# EasyEDA Pro project Excam多功能小相机.epro, board PCB2_1
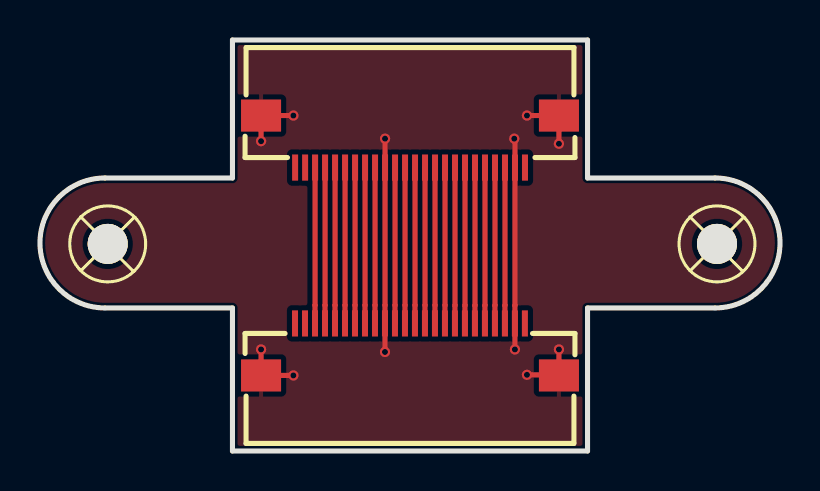
[diagram p0: board, top side]
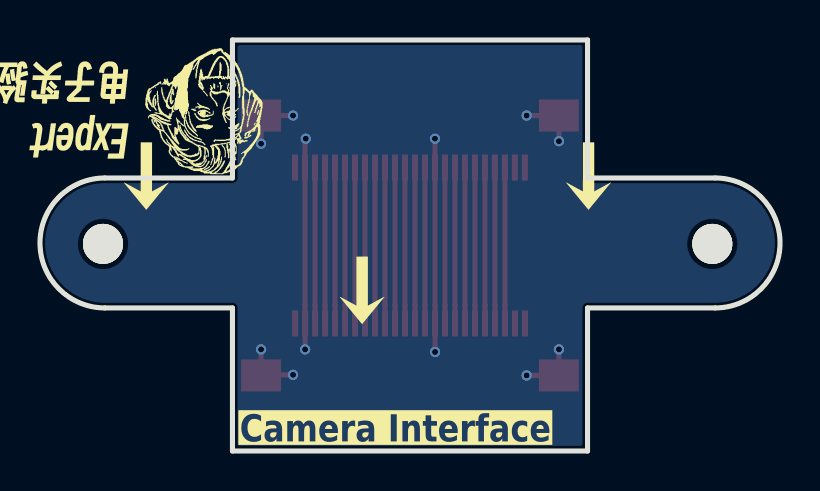
[diagram p1: board, bottom side, seen from below]

Outline 37.02 x 20.56 mm; copper layers: Top Layer, Bottom Layer. Coordinates in mm from the lower left corner of the outline.
Outline path: 3.25,13.66 9.63,13.66 9.63,20.56 27.39,20.56 27.39,13.66 33.77,13.66 arc(37.02,10.41) 33.77,7.16 27.39,7.16 27.39,0 9.63,0 9.63,7.16 3.25,7.16 arc(0,10.41) 3.25,13.66
Stack: Top Layer 0.035mm / Dielectric1 1.51mm FR4 er 4.5 / Bottom Layer 0.035mm

## Design rules (mm)
template: 自定义配置
spacing copperThickness1oz (default): track to track 0.102, other pairs 0.152 to 0.3
spacing copperThickness2oz: track to track 0.203, other pairs 0.152 to 0.3
track width copperThickness1oz (default): min 0.127, default 0.254, max 2.54
track width copperThickness2oz: min 0.203, default 0.254, max 2.54
differential pair differentialPair (default): width min 0.127, default 0.254, max 2.54; gap min 0.152, default 0.152
via viaSize (default): diameter min 0.5, default 0.61, max 10; hole min 0.3, default 0.305, max 6.3

## Placement (name value [footprint] x y rotation side)
FPC1  AFC01-S24FCA-00  [FPC-SMD_P0.50-24P_FGS-XJ-H2.0]  18.51 15.48 0 top
FPC2  AFC01-S24FCA-00  [FPC-SMD_P0.50-24P_FGS-XJ-H2.0]  18.51 5.08 180 top
TP1  -  [M2螺丝]  33.87 10.36 180 top
TP2  -  [M2螺丝]  3.39 10.36 180 top

## Footprints (pads in the part's own frame, mm; a bottom-side part is the same pattern mirrored in y, then rotated)
FPC-SMD_P0.50-24P_FGS-XJ-H2.0
  rect 0.3x1.3 smd: 1(-5.748,-1.3) 2(-5.248,-1.3) 3(-4.748,-1.3) 4(-4.248,-1.3) 5(-3.748,-1.3) 6(-3.248,-1.3) 7(-2.748,-1.3) 8(-2.248,-1.3) 9(-1.748,-1.3) 10(-1.248,-1.3) 11(-0.748,-1.3) 12(-0.248,-1.3) 13(0.252,-1.3) 14(0.752,-1.3) 15(1.252,-1.3) 16(1.752,-1.3) 17(2.252,-1.3) 18(2.752,-1.3) 19(3.252,-1.3) 20(3.752,-1.3) 21(4.252,-1.3) 22(4.752,-1.3) 23(5.252,-1.3) 24(5.752,-1.3)
  rect 2x1.6 smd: 25(7.45,1.3) 26(-7.45,1.3)
M2螺丝
  round 2 hole 2: 1(0,0)

## Nets
1.5V: FPC1.15 FPC2.10
2.8V-A: FPC1.21 FPC2.4
2.8V-D: FPC1.14 FPC2.11
GND: FPC1.10 FPC1.23 FPC1.25 FPC1.26 FPC2.2 FPC2.15 FPC2.25 FPC2.26
DCMI_CLK: FPC1.12 FPC2.13
DCMI_D0: FPC1.6 FPC2.19
DCMI_D1: FPC1.4 FPC2.21
DCMI_D2: FPC1.3 FPC2.22
DCMI_D3: FPC1.5 FPC2.20
DCMI_D4: FPC1.7 FPC2.18
DCMI_D5: FPC1.9 FPC2.16
DCMI_D6: FPC1.11 FPC2.14
DCMI_D7: FPC1.13 FPC2.12
DCMI_HSYNC: FPC1.16 FPC2.9
DCMI_PCLK: FPC1.8 FPC2.17
DCMI_PWDN: FPC1.17 FPC2.8
DCMI_RST: FPC1.19 FPC2.6
DCMI_VSYNC: FPC1.18 FPC2.7
I2C1_SCL: FPC1.20 FPC2.5
I2C1_SDA: FPC1.22 FPC2.3

Pads without a net: FPC1 1 2 24; FPC2 1 23 24; TP1 1; TP2 1

## Via types
v1: diameter 0.51, hole 0.305, Top Layer to Bottom Layer, 12 vias

## Routing (per net, layer and track width the routed paths; a pad name or vN(x,y) marks a point on that pad's centre or on a via; arc(x,y) is an arc through that point)
1.5V: length 7.8
  Top Layer w0.254: 19.76,6.38 19.76,7.28 19.76,7.29 FPC1.15
2.8V-A: length 7.8
  Top Layer w0.254: 22.76,6.38 22.76,7.28 22.76,7.29 FPC1.21
2.8V-D: length 7.8
  Top Layer w0.254: FPC1.14 19.26,7.29 19.26,7.28 19.26,6.38
GND: length 33
  Top Layer w0.254: v1(12.68,16.78) FPC1.26 v1(11.06,15.49) ; v1(17.26,4.95) 17.26,7.28 17.26,7.29 FPC1.10 v1(17.26,15.62) ; v1(25.96,15.37) FPC1.25 v1(24.36,16.78) ; v1(23.73,15.62) 23.76,15.58 FPC1.23 23.76,7.29 23.76,7.28 v1(23.76,5.08) ; v1(11.06,5.08) FPC2.25 v1(12.68,3.78) ; v1(24.36,3.81) 25.93,3.81 FPC2.26 v1(25.96,5.08)
DCMI_CLK: length 7.8
  Top Layer w0.254: FPC1.12 18.26,7.29 18.26,7.28 18.26,6.38
DCMI_D0: length 7.8
  Top Layer w0.254: 15.26,6.38 15.26,7.28 15.26,7.29 FPC1.6
DCMI_D1: length 7.8
  Top Layer w0.254: FPC1.4 14.26,7.29 14.26,7.28 14.26,6.38
DCMI_D2: length 7.8
  Top Layer w0.254: FPC1.3 13.76,7.29 13.76,7.28 13.76,6.38
DCMI_D3: length 7.8
  Top Layer w0.254: FPC1.5 14.76,7.29 14.76,7.28 14.76,6.38
DCMI_D4: length 7.8
  Top Layer w0.254: FPC1.7 15.76,7.29 15.76,7.28 15.76,6.38
DCMI_D5: length 7.8
  Top Layer w0.254: 16.76,6.38 16.76,7.28 16.76,7.29 FPC1.9
DCMI_D6: length 7.8
  Top Layer w0.254: FPC1.11 17.76,7.29 17.76,7.28 17.76,6.38
DCMI_D7: length 7.8
  Top Layer w0.254: FPC1.13 18.76,7.29 18.76,7.28 18.76,6.38
DCMI_HSYNC: length 7.8
  Top Layer w0.254: 20.26,6.38 20.26,7.28 20.26,7.29 FPC1.16
DCMI_PCLK: length 7.8
  Top Layer w0.254: 16.26,6.38 16.26,7.28 16.26,7.29 FPC1.8
DCMI_PWDN: length 7.8
  Top Layer w0.254: 20.76,6.38 20.76,7.28 20.76,7.29 FPC1.17
DCMI_RST: length 7.8
  Top Layer w0.254: FPC1.19 21.76,7.29 21.76,7.28 21.76,6.38
DCMI_VSYNC: length 7.8
  Top Layer w0.254: 21.26,6.38 21.26,7.28 21.26,7.29 FPC1.18
I2C1_SCL: length 7.8
  Top Layer w0.254: 22.26,6.38 22.26,7.28 22.26,7.29 FPC1.20
I2C1_SDA: length 7.8
  Top Layer w0.254: 23.26,6.38 23.26,7.28 23.26,7.29 FPC1.22

## Copper pours and planes (outline as drawn; the poured copper is in the pictures)
GND on Top Layer: -1.17,23.88 39.6,23.88 39.6,-2.54 -1.17,-2.54
GND on Bottom Layer: -1.93,24.51 40.24,24.51 40.24,-3.17 -1.93,-3.17

## Text on the board
Bottom Silkscreen Layer: Camera Interface
